# EasyEDA schematic SCH_sensors_2026-04-29.json
TITLE: Sheet_1; REV: 1.0; Date: 2026-04-29; Sheet: 1/1; Drawn By: milenamayilyan5; Company: Your Company
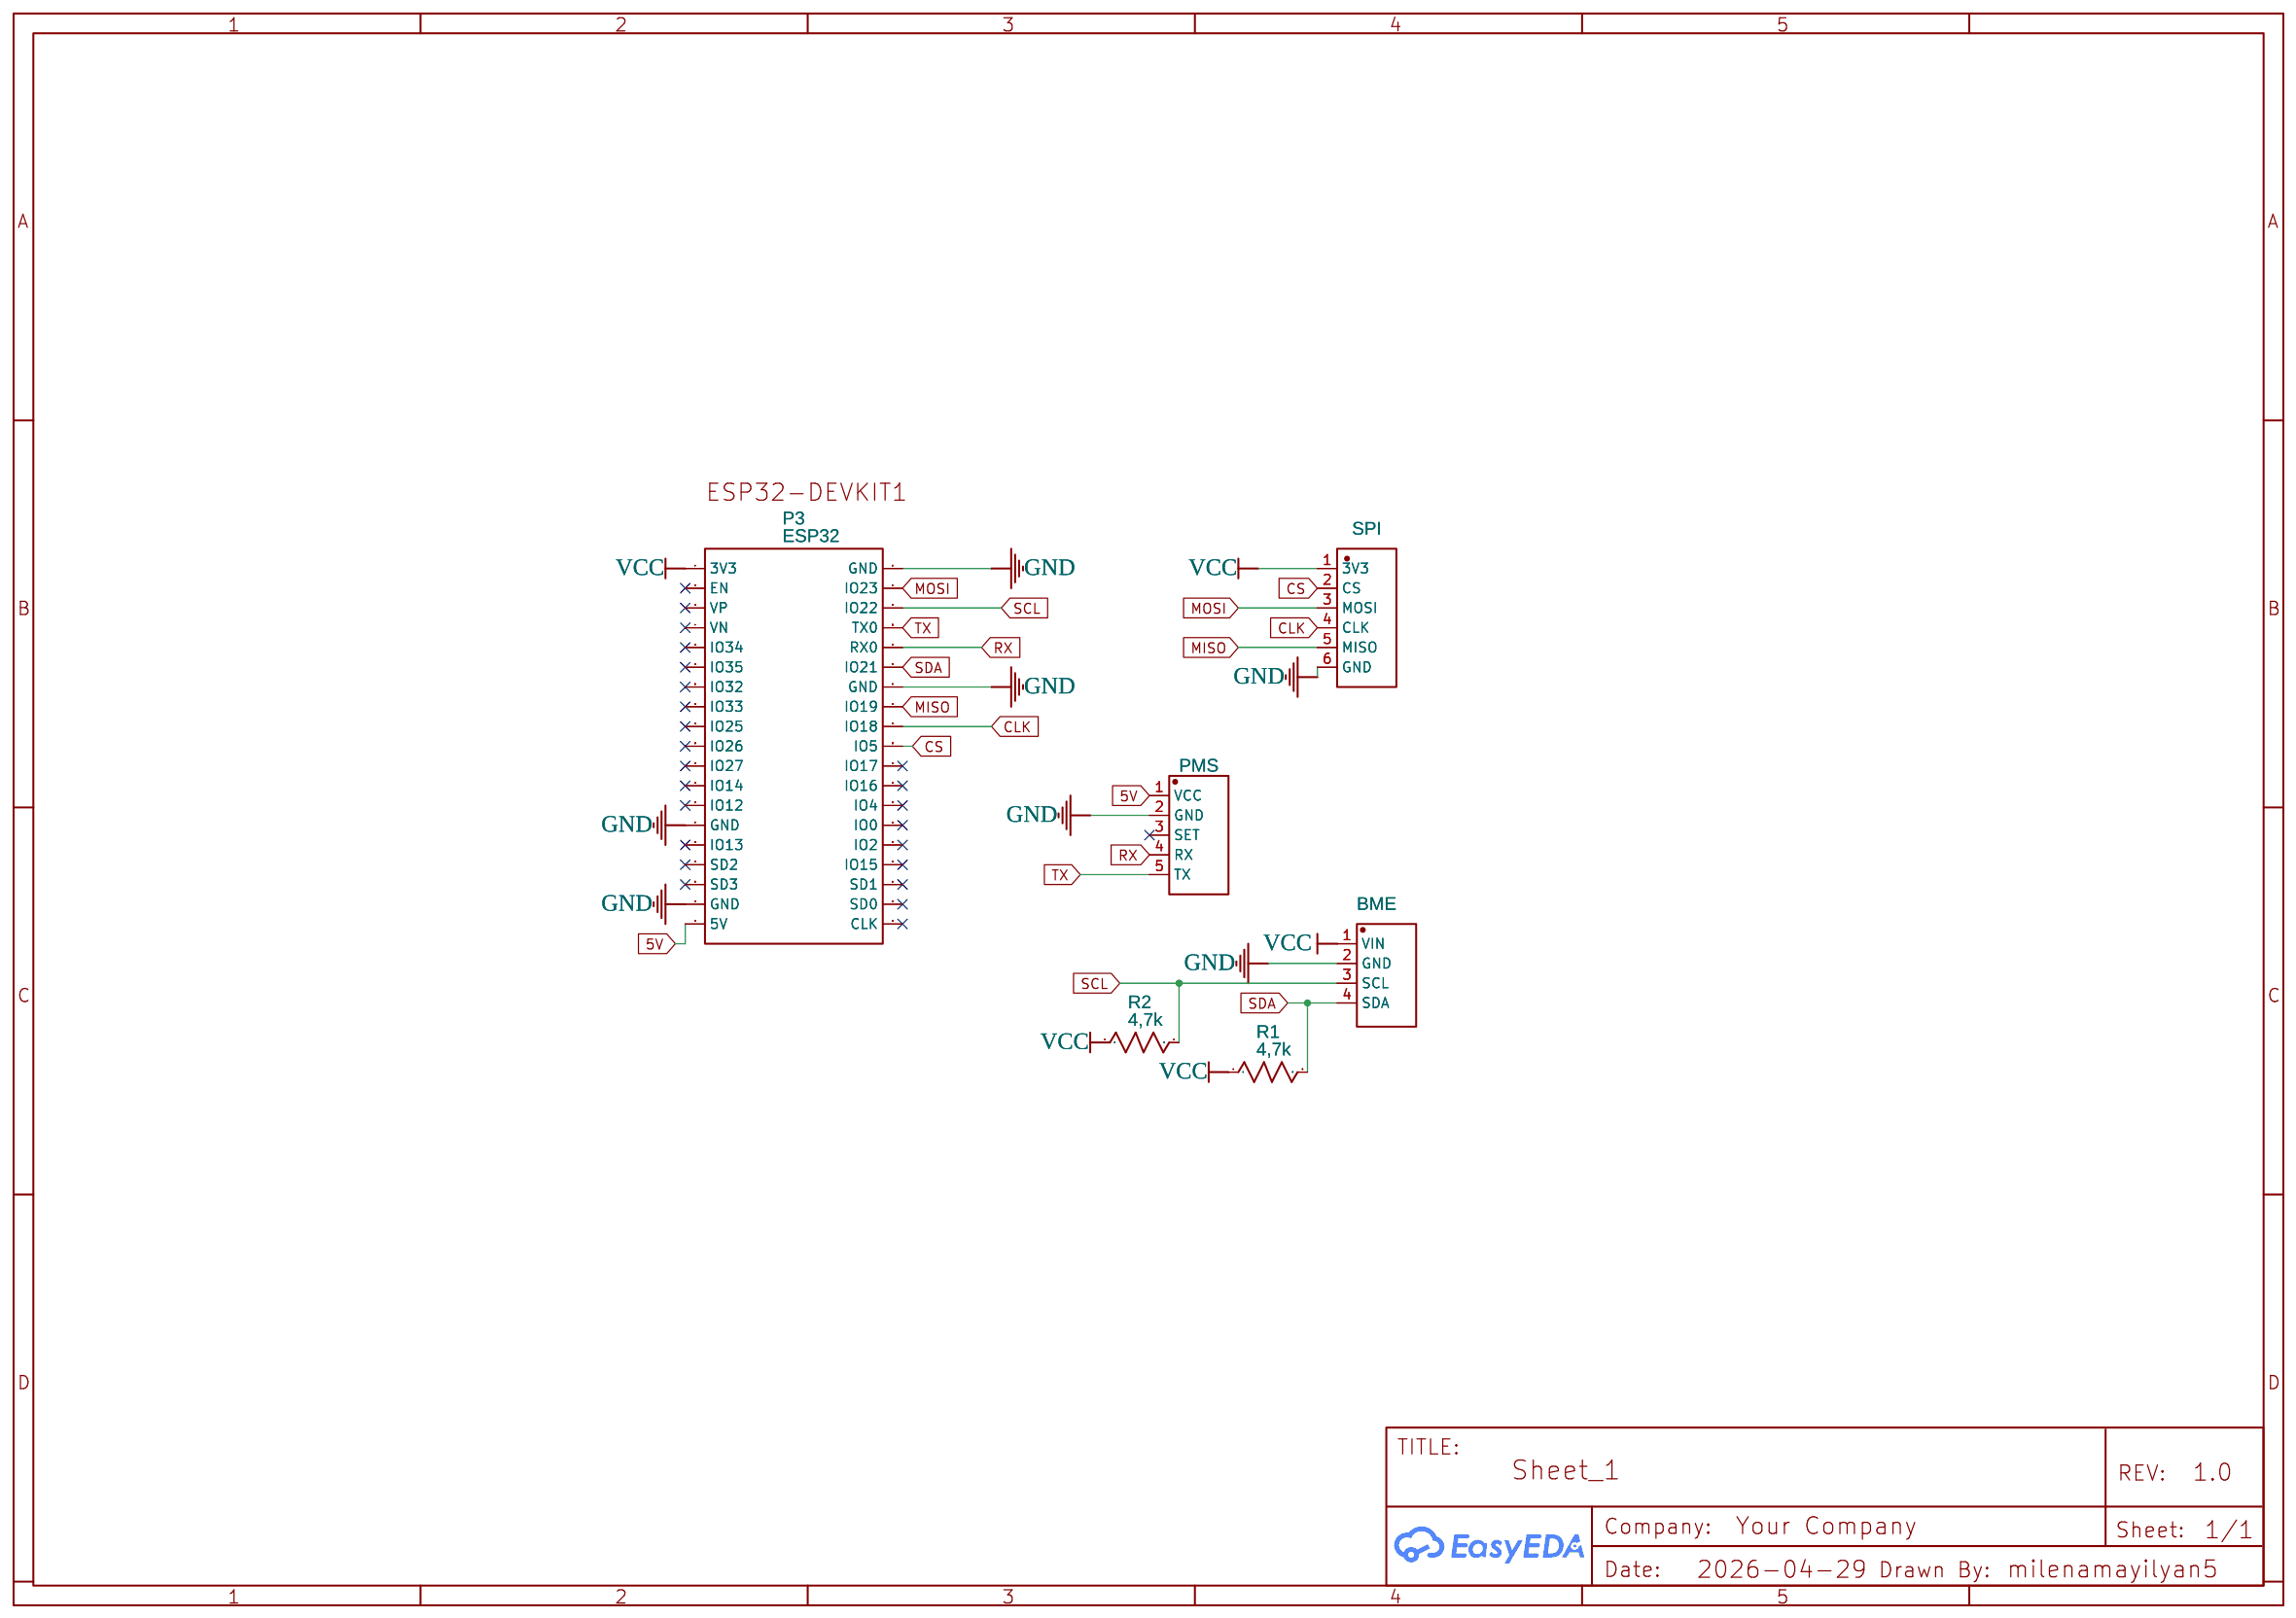
[diagram p0: schematic sheet]

## Parts
BME  I2C RAIL COPY  [HEADER - HEADER-FEMALE-2.54_1X4]
BME1  SPI  [HEADER-HEADER-FEMALE-2.54_1X6]
P3  ESP32  [DUPONT 2X19 HEADER 2.54MM]
PMS  HEADER - 2.54_1X5  [HEADER-HEADER-FEMALE-2.54_1X5]
R1  4,7k  [R0603]
R2  4,7k  [R0603]

## Library data of the parts
BME = I2C RAIL COPY: Contributor: chrisrisse; Supplier: Sparkfun
BME1 = header male L298N 1x6 2.54: Contributor: emmrivas39; Package Display: No
P3 = ESP32: Supplier: LCSC; Manufacturer: ReliaPro; Manufacturer Part: Header-Male-2.54_2x19; image: http://image.lceda.cn/szlcsc/C50980.jpg; Supplier Part: C124383; Contributor: yapayzeka1363
PMS = HEADER - 2.54_1X5: Contributor: luxgeca
R1 R2 = R_0603_US: Contributor: LCEDA_Lib

## Nets
5V: P3.37(5V) PMS.1(VCC)
GND: BME.2(GND) BME1.6(GND) P3.2(GND) P3.14(GND) P3.27(GND) P3.35(GND) PMS.2(GND)
VCC: BME.1(VIN) BME1.1(3V3) P3.1(3V3) R1.1 R2.1
CLK: BME1.4(CLK) P3.18(IO18)
CS: BME1.2(CS) P3.20(IO5)
MISO: BME1.5(MISO) P3.16(IO19)
MOSI: BME1.3(MOSI) P3.4(IO23)
RX: P3.10(RX0) PMS.4(RX)
SCL: BME.3(SCL) P3.6(IO22) R2.2
SDA: BME.4(SDA) P3.12(IO21) R1.2
TX: P3.8(TX0) PMS.5(TX)

Not connected (* = marked no-connect by the designer): P3 3(EN)* 5(VP)* 7(VN)* 9(IO34)* 11(IO35)* 13(IO32)* 15(IO33)* 17(IO25)* 19(IO26)* 21(IO27)* 22(IO17)* 23(IO14)* 24(IO16)* 25(IO12)* 26(IO4)* 28(IO0)* 29(IO13)* 30(IO2)* 31(SD2)* 32(IO15)* 33(SD3)* 34(SD1)* 36(SD0)* 38(CLK)*; PMS 3(SET)*
